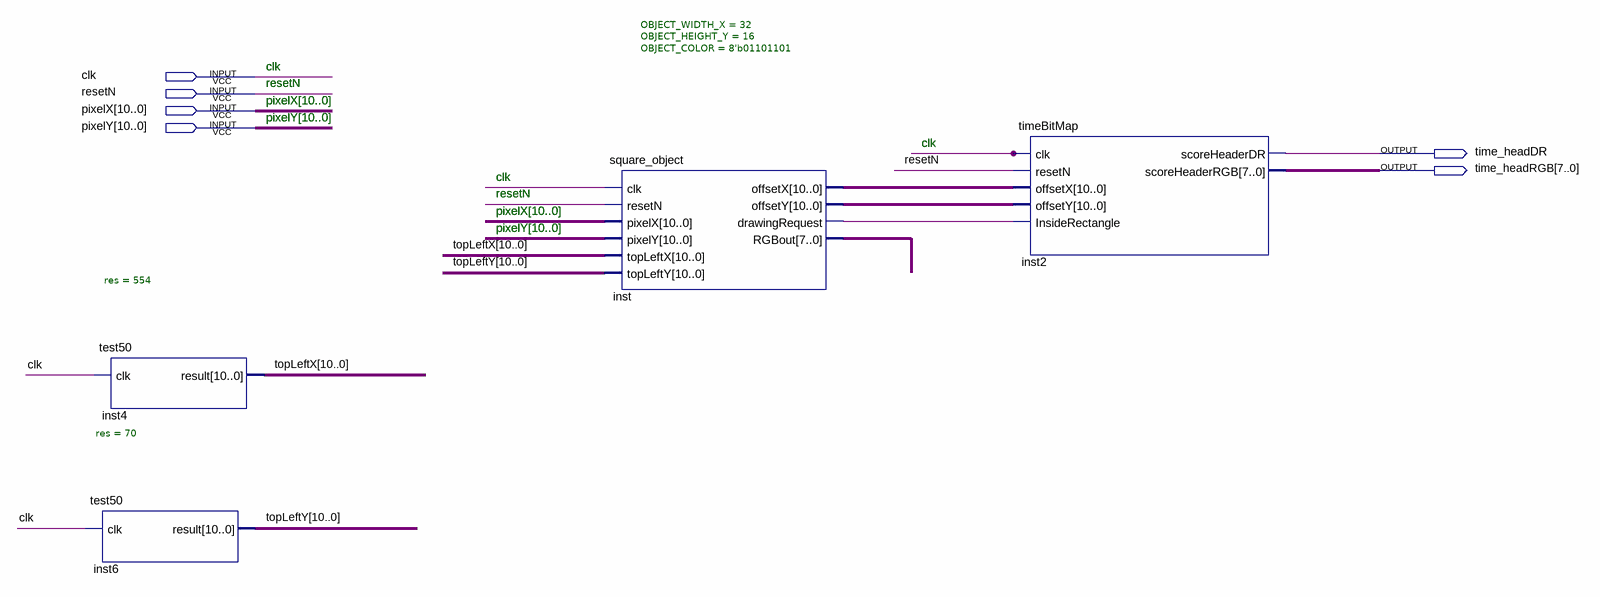
[diagram p0: schematic sheet]
// Quartus schematic time_display.bdf as structural Verilog: 4 symbols, 6 pins
module time_display (
  input  clk,
  input  resetN,
  input  [10:0] pixelX,
  input  [10:0] pixelY,
  output time_headDR,
  output [7:0] time_headRGB
);

  wire inst_drawingrequest;
  wire [7:0] inst_rgbout;
  wire [10:0] inst_offsetx, inst_offsety, topLeftX, topLeftY;

  test50 #(.res(554)) inst4 (.clk(clk), .result(topLeftX));
  test50 #(.res(70)) inst6 (.clk(clk), .result(topLeftY));
  square_object #(.OBJECT_WIDTH_X(32), .OBJECT_HEIGHT_Y(16), .OBJECT_COLOR(8'b01101101)) inst (
    .clk(clk), .resetN(resetN), .pixelX(pixelX), .pixelY(pixelY), .topLeftX(topLeftX), .topLeftY(topLeftY),
    .offsetX(inst_offsetx), .offsetY(inst_offsety), .drawingRequest(inst_drawingrequest), .RGBout(inst_rgbout));
  timeBitMap inst2 (
    .clk(clk), .resetN(resetN), .offsetX(inst_offsetx), .offsetY(inst_offsety),
    .InsideRectangle(inst_drawingrequest), .scoreHeaderDR(time_headDR), .scoreHeaderRGB(time_headRGB));

  // Notes on the sheet:
  //   clk
  //   clk
  //   resetN
  //   resetN
  //   pixelX[10..0]
  //   pixelX[10..0]
  //   pixelY[10..0]
  //   pixelY[10..0]
  //   clk
  //   clk
  //   clk
  //   clk
  //   resetN
  //   resetN
  //   pixelX[10..0]
  //   pixelX[10..0]
  //   pixelY[10..0]
  //   pixelY[10..0]
endmodule
